# EAGLE board NeoKey 5x6 Ortho Snap-Apart (EAGLE 9.6.2), part 1 of 2
REV: B
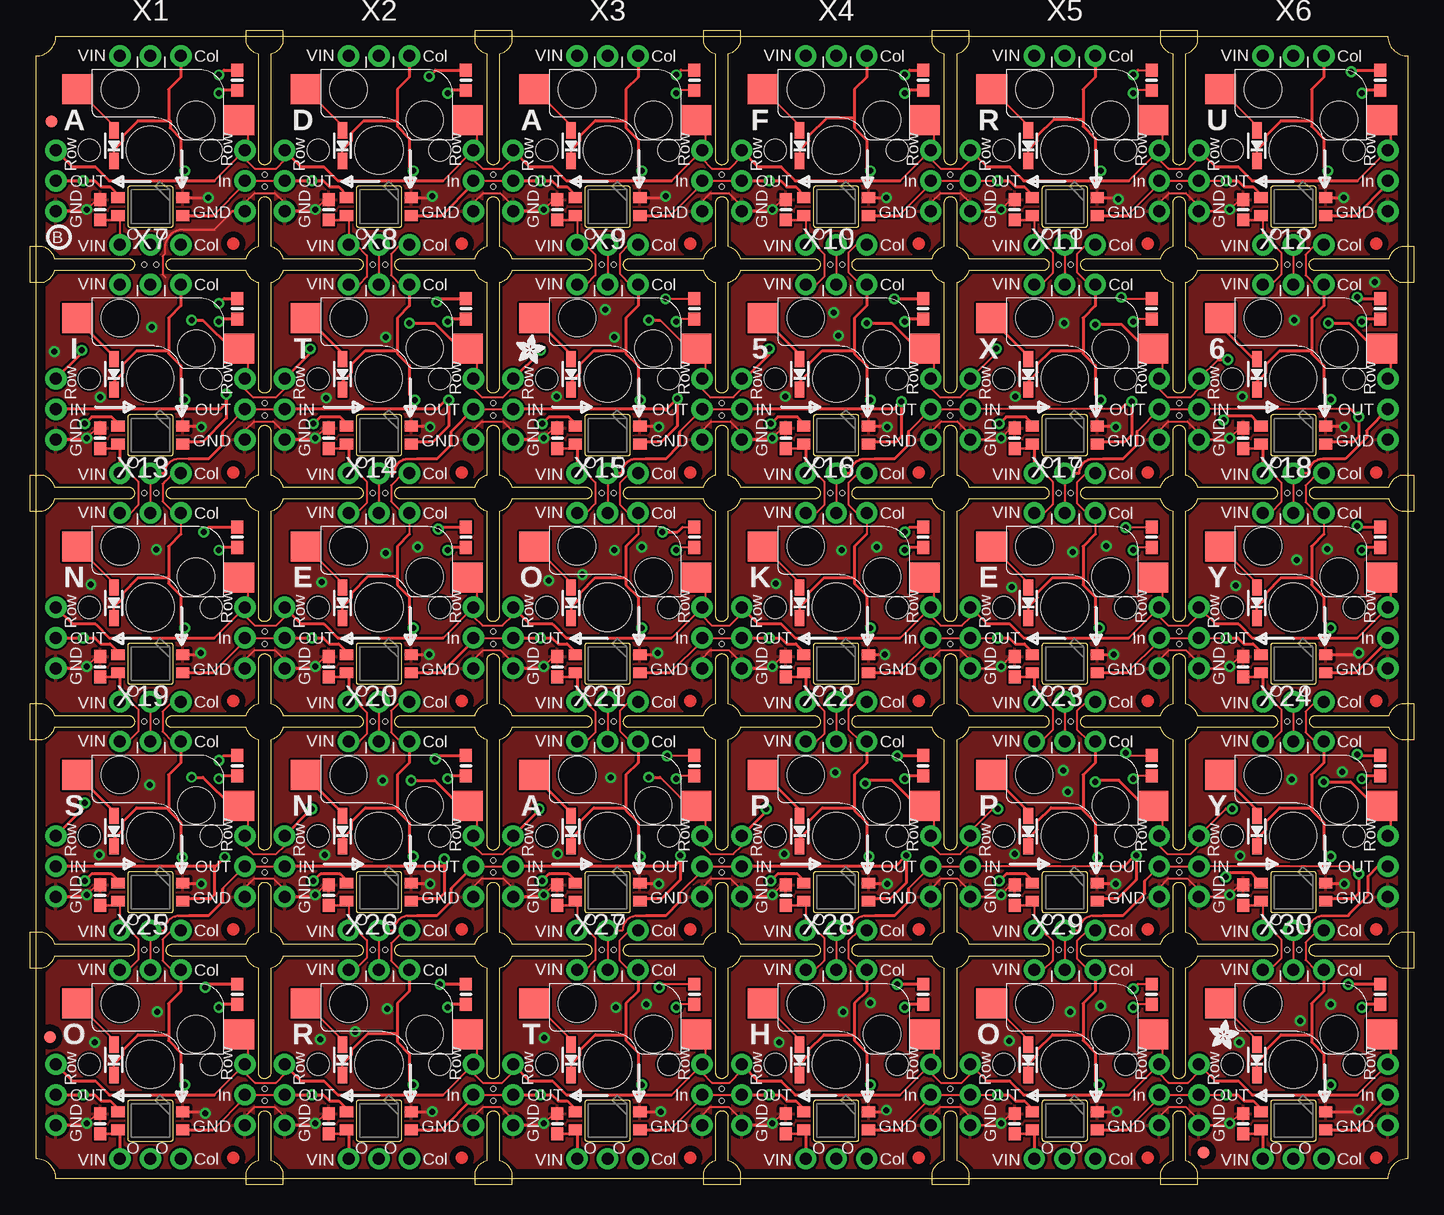
[diagram p1: board, top side]
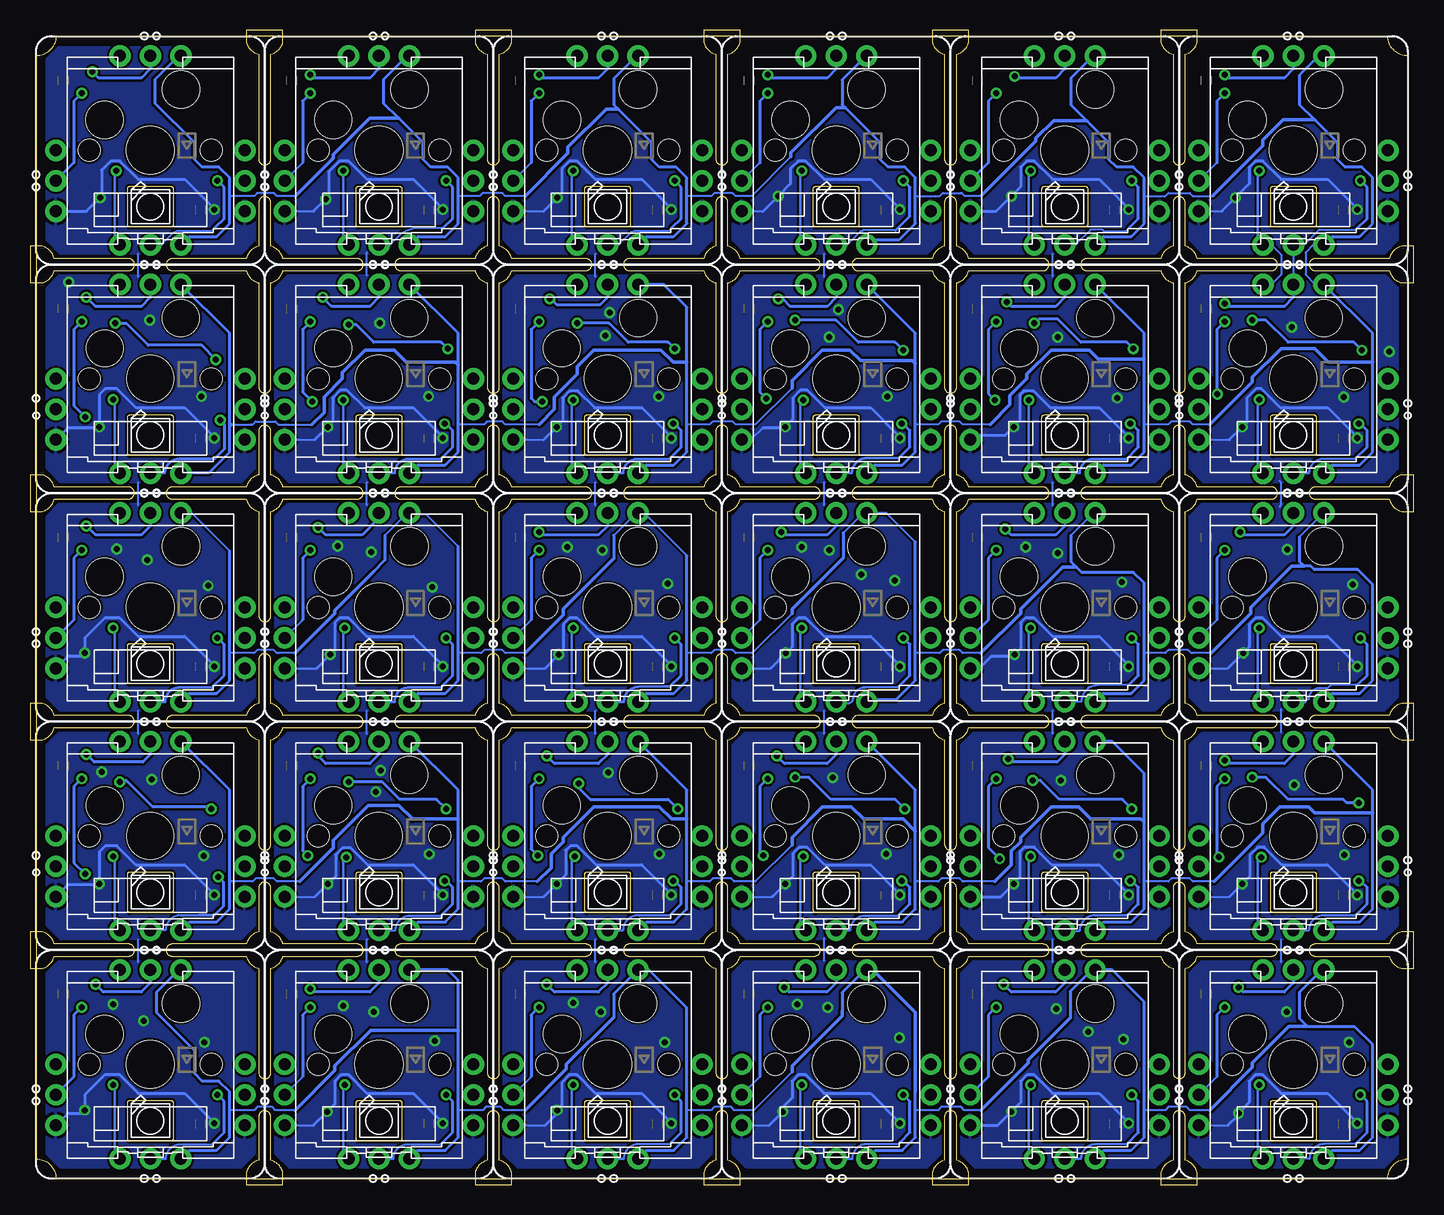
[diagram p2: board, bottom side, seen from below]

Size 115.32 x 96.27 mm. Coordinates in mm from the lower left corner, seen from the top.
Outline: 0.51,94.11 arc90 2.16,95.76 113.16,95.76 arc90 114.81,94.11 114.81,2.16 arc90 113.16,0.51 2.16,0.51 arc90 0.51,2.16 0.51,94.11
Copper layers (1*16): Top 0.035mm / dielectric 1.5mm / Bottom 0.035mm
Design rules "adafruit 7-7 *": minimum track width 7mil, minimum drill 15.5mil, track to track 7mil, track to pad 7mil, pad to pad 7mil, via to via 7mil, smd to smd 7mil, copper to edge 8mil, drill to drill 8mil, minimum pad ring 10mil, minimum via ring 8mil, stop-mask expansion 2mil, vias tented up to drill 20mil, thermal gap 10mil
Holes 0.4 mm at 19.56,83.19 38.61,83.19 57.66,83.19 76.71,83.19 95.76,83.19 9.52,76.71 10.54,76.71 28.58,76.71 29.59,76.71 47.62,76.71 48.64,76.71 66.67,76.71 67.69,76.71 85.72,76.71 86.74,76.71 104.78,76.71 105.79,76.71 19.56,65.15 19.56,64.14 38.61,65.15 38.61,64.14 57.66,65.15 57.66,64.14 76.71,65.15 76.71,64.14 95.76,65.15 95.76,64.14 9.52,57.66 10.54,57.66 28.58,57.66 29.59,57.66 47.62,57.66 48.64,57.66 66.67,57.66 67.69,57.66 85.72,57.66 86.74,57.66 104.78,57.66 105.79,57.66 19.56,46.1 19.56,45.09 38.61,46.1 38.61,45.09 57.66,46.1 57.66,45.09 76.71,46.1 76.71,45.09 95.76,46.1 95.76,45.09 9.52,38.61 10.54,38.61 28.58,38.61 29.59,38.61 47.62,38.61 48.64,38.61 66.67,38.61 67.69,38.61 85.72,38.61 86.74,38.61 104.78,38.61 105.79,38.61 19.56,27.05 19.56,26.04 38.61,27.05 38.61,26.04 57.66,27.05 57.66,26.04 76.71,27.05 76.71,26.04 95.76,27.05 95.76,26.04 9.52,19.56 10.54,19.56 28.58,19.56 29.59,19.56 47.62,19.56 48.64,19.56 66.67,19.56 67.69,19.56 85.72,19.56 86.74,19.56 104.78,19.56 105.79,19.56 19.56,8 19.56,6.98 38.61,8 38.61,6.98 57.66,8 57.66,6.98 76.71,8 76.71,6.98 95.76,8 95.76,6.98 95.76,84.2 76.71,84.2 57.66,84.2 38.61,84.2 19.56,84.2

## Footprints (pad centres in the part's own frame; a part is rotated, then mirrored left to right if it is on the bottom)
FIDUCIAL_1MM = smd 1 x 1: 1 0,0
KAILH_SOCKET_TILE = smd 1.1 x 0.9 bottom: 1-VDD 2.7,-5.449; 2-DOUT 2.7,-3.949; 3-GND -2.7,-3.949; 4-DIN -2.7,-5.449 | smd 2.55 x 2.5 bottom: A -7.36,2.5; DA 6.09,5.08 | drill 1 pad 1.778: A1 -7.874,0; A2 7.874,0; C1 -2.54,7.874; C2 -2.54,-7.874; DIN -7.874,-2.54; DIN_C 0,7.874; DOUT 7.874,-2.54; DOUT1 0,-7.874; GND1 -7.874,-5.08; GND2 7.874,-5.08; VDD1 2.54,7.874; VDD2 2.54,-7.874 | smd 0.8 x 1.35 bottom: C 3.048,-0.889; D+ 3.048,1.651 | smd 1 x 1.075 bottom: C+ 4.191,-5.803; C- 4.191,-4.103; DIN1 -7.239,4.992; DIN_C1 -7.239,6.692 | hole 4: 0,0 | hole 3.1: 2.54,5.08; -3.81,2.54 | hole 1.813: 5.08,0; -5.08,0
KAILH_SOCKET_TILE_REV = smd 1.1 x 0.9 bottom: 1-VDD 2.7,-5.449; 2-DOUT 2.7,-3.949; 3-GND -2.7,-3.949; 4-DIN -2.7,-5.449 | smd 2.55 x 2.5 bottom: A -7.36,2.5; DA 6.09,5.08 | drill 1 pad 1.778: A1 -7.874,0; A2 7.874,0; C1 -2.54,7.874; C2 -2.54,-7.874; DIN 7.874,-2.54; DIN_C 0,7.874; DOUT -7.874,-2.54; DOUT1 0,-7.874; GND1 -7.874,-5.08; GND2 7.874,-5.08; VDD1 2.54,7.874; VDD2 2.54,-7.874 | smd 0.8 x 1.35 bottom: C 3.048,-0.889; D+ 3.048,1.651 | smd 1 x 1.075 bottom: C+ 4.191,-5.803; C- 4.191,-4.103; DIN1 -7.239,4.992; DIN_C1 -7.239,6.692 | hole 3.9: 0,0 | hole 3.063: 2.54,5.08; -3.81,2.54 | hole 1.813: 5.08,0; -5.08,0

## Placement (x,y rotation side)
U$1  FIDUCIAL  [FIDUCIAL_1MM]  1.65,12.32 0 top
U$2  FIDUCIAL  [FIDUCIAL_1MM]  97.79,2.67 0 top
U$3  FIDUCIAL  [FIDUCIAL_1MM]  1.78,88.65 0 top
U$4  [ADAFRUIT_2.5MM]  40.51,68.45 0 top
U$5  [ADAFRUIT_2.5MM]  98.3,11.3 0 top
U$6  [PCBFEAT-REV-040]  2.41,78.99 180 top
X1  KAILH_SOCKET_TILE  [KAILH_SOCKET_TILE]  10.03,86.23 0 bottom
X2  KAILH_SOCKET_TILE  [KAILH_SOCKET_TILE]  29.08,86.23 0 bottom
X3  KAILH_SOCKET_TILE  [KAILH_SOCKET_TILE]  48.13,86.23 0 bottom
X4  KAILH_SOCKET_TILE  [KAILH_SOCKET_TILE]  67.18,86.23 0 bottom
X5  KAILH_SOCKET_TILE  [KAILH_SOCKET_TILE]  86.23,86.23 0 bottom
X6  KAILH_SOCKET_TILE  [KAILH_SOCKET_TILE]  105.28,86.23 0 bottom
X7  KAILH_SOCKET_TILE_REVERSE  [KAILH_SOCKET_TILE_REV]  10.03,67.18 0 bottom
X8  KAILH_SOCKET_TILE_REVERSE  [KAILH_SOCKET_TILE_REV]  29.08,67.18 0 bottom
X9  KAILH_SOCKET_TILE_REVERSE  [KAILH_SOCKET_TILE_REV]  48.13,67.18 0 bottom
X10  KAILH_SOCKET_TILE_REVERSE  [KAILH_SOCKET_TILE_REV]  67.18,67.18 0 bottom
X11  KAILH_SOCKET_TILE_REVERSE  [KAILH_SOCKET_TILE_REV]  86.23,67.18 0 bottom
X12  KAILH_SOCKET_TILE_REVERSE  [KAILH_SOCKET_TILE_REV]  105.28,67.18 0 bottom
X13  KAILH_SOCKET_TILE  [KAILH_SOCKET_TILE]  10.03,48.13 0 bottom
X14  KAILH_SOCKET_TILE  [KAILH_SOCKET_TILE]  29.08,48.13 0 bottom
X15  KAILH_SOCKET_TILE  [KAILH_SOCKET_TILE]  48.13,48.13 0 bottom
X16  KAILH_SOCKET_TILE  [KAILH_SOCKET_TILE]  67.18,48.13 0 bottom
X17  KAILH_SOCKET_TILE  [KAILH_SOCKET_TILE]  86.23,48.13 0 bottom
X18  KAILH_SOCKET_TILE  [KAILH_SOCKET_TILE]  105.28,48.13 0 bottom
X19  KAILH_SOCKET_TILE_REVERSE  [KAILH_SOCKET_TILE_REV]  10.03,29.08 0 bottom
X20  KAILH_SOCKET_TILE_REVERSE  [KAILH_SOCKET_TILE_REV]  29.08,29.08 0 bottom
X21  KAILH_SOCKET_TILE_REVERSE  [KAILH_SOCKET_TILE_REV]  48.13,29.08 0 bottom
X22  KAILH_SOCKET_TILE_REVERSE  [KAILH_SOCKET_TILE_REV]  67.18,29.08 0 bottom
X23  KAILH_SOCKET_TILE_REVERSE  [KAILH_SOCKET_TILE_REV]  86.23,29.08 0 bottom
X24  KAILH_SOCKET_TILE_REVERSE  [KAILH_SOCKET_TILE_REV]  105.28,29.08 0 bottom
X25  KAILH_SOCKET_TILE  [KAILH_SOCKET_TILE]  10.03,10.03 0 bottom
X26  KAILH_SOCKET_TILE  [KAILH_SOCKET_TILE]  29.08,10.03 0 bottom
X27  KAILH_SOCKET_TILE  [KAILH_SOCKET_TILE]  48.13,10.03 0 bottom
X28  KAILH_SOCKET_TILE  [KAILH_SOCKET_TILE]  67.18,10.03 0 bottom
X29  KAILH_SOCKET_TILE  [KAILH_SOCKET_TILE]  86.23,10.03 0 bottom
X30  KAILH_SOCKET_TILE  [KAILH_SOCKET_TILE]  105.28,10.03 0 bottom

## Tracks (layer width: path | path; a pad name or v marks a point on that pad's centre or on a via)
COL1  (via drill 0.5)
  Top 0.178: 12.57,54.23 X13.C1 12,56.01 11.05,56.96 11.05,58.42 11.24,58.61 11.3,58.67 11.94,59.31 X7.C2 | 11.87,40.26 11.05,39.43 11.05,37.78 11.87,36.96 | X19.C2 11.81,21.21 11.05,20.45 11.05,18.67 11.81,17.91
  Top 0.203: X1.C 6.98,86.25 | X7.C 6.98,66.95 | X13.C 6.98,48.15 | X19.C 6.98,28.85 | X13.C2 11.87,40.26 | 11.87,36.96 X19.C1 | X25.C 6.98,10.05 | 11.81,17.91 X25.C1
  Top 0.254: X1.C1 12.57,92.33 11.56,91.31 11.56,88.71 | v12.89,84.52 12.89,84.65 12.57,84.96 12.57,87.21 11.68,88.1 11.68,88.71 11.56,88.71 | 6.98,86.25 7.75,87.02 7.75,87.45 9.02,88.71 11.56,88.71 | X7.C1 12.57,73.28 11.56,72.26 11.56,69.53 | 11.56,69.53 11.56,69.3 12.57,68.29 12.57,65.79 v12.89,65.47 | 6.98,66.95 7.75,67.72 7.75,68.4 8.89,69.53 11.56,69.53 | 12.57,54.23 11.56,53.21 11.56,50.61 | 11.56,50.61 11.56,50.13 12.57,49.11 12.57,46.74 v12.89,46.42 | 6.98,48.15 7.75,48.92 7.75,49.35 9.02,50.61 11.56,50.61 | X19.C1 12.57,35.18 11.56,34.16 11.56,31.43 | 11.56,31.43 11.56,31.2 12.57,30.19 12.57,27.43 v12.7,27.31 | 6.98,28.85 7.75,29.62 7.75,30.3 8.89,31.43 11.56,31.43 | X25.C1 12.57,16.13 11.56,15.11 11.56,12.51 | 11.56,12.51 11.56,12.03 12.57,11.01 12.57,8.64 v12.89,8.32 | 6.98,10.05 7.75,10.82 7.75,11.25 9.02,12.51 11.56,12.51
  Bottom 0.178: 13.02,79.06 12.57,78.61 X1.C2 11.87,78.36 11.05,77.53 11.05,75.88 11.87,75.06 | 12.57,21.46 X19.C2
  Bottom 0.203: v12.89,84.52 13.02,84.39 13.02,79.06 | X7.C2 12.57,59.56 13.02,60.01 13.02,65.34 v12.89,65.47 | 11.87,75.06 X7.C1 | X13.C2 12.57,40.51 13.02,40.96 13.02,46.29 v12.89,46.42 | 12.57,21.46 13.02,21.91 13.02,26.99 v12.7,27.31 | X25.C2 12.57,2.41 13.02,2.86 13.02,8.19 v12.89,8.32
COL2  (via drill 0.5)
  Top 0.178: X2.C2 30.86,78.36 30.1,77.6 30.1,75.82 30.86,75.06 | 31.62,54.23 X14.C1 31.05,56.01 30.1,56.96 30.1,58.29 31.12,59.31 X8.C2 | 30.86,40.26 30.1,39.5 30.1,37.72 30.86,36.96 | X20.C2 31.18,21.21 30.1,20.13 30.1,18.67 30.86,17.91
  Top 0.203: X2.C 26.03,86.25 | X8.C 26.03,66.95 | 30.86,75.06 X8.C1 | X14.C 26.03,48.15 | X20.C 26.03,28.85 | X14.C2 30.86,40.26 | 30.86,36.96 X20.C1 | X26.C 26.03,10.05 | 30.86,17.91 X26.C1
  Top 0.254: X2.C1 31.62,92.33 30.61,91.31 30.61,88.71 | 30.61,88.71 30.61,88.23 31.62,87.21 31.62,84.84 v31.94,84.52 | 26.03,86.25 26.8,87.02 26.8,87.7 27.81,88.71 30.61,88.71 | X8.C1 31.62,73.28 30.61,72.26 30.61,69.53 | 30.61,69.53 30.61,69.3 31.62,68.29 31.62,65.85 v32.07,65.41 | 26.03,66.95 26.8,67.72 26.8,68.4 27.94,69.53 30.61,69.53 | 31.62,54.23 30.61,53.21 30.61,50.74 | 30.61,50.74 30.61,50 31.62,48.98 31.62,46.74 v31.94,46.42 | 26.03,48.15 26.8,48.92 26.8,49.35 28.19,50.74 30.61,50.74 | X20.C1 31.62,35.18 30.61,34.16 30.61,31.43 | 30.61,31.43 30.61,31.2 31.62,30.19 31.62,27.69 v31.94,27.37 | 26.03,28.85 26.8,29.62 26.8,30.3 27.94,31.43 30.61,31.43 | X26.C1 31.62,16.13 30.61,15.11 30.61,12.64 | 30.61,12.64 30.61,11.9 31.62,10.88 31.62,8.64 v31.94,8.32 | 26.03,10.05 26.8,10.82 26.8,11.25 28.19,12.64 30.61,12.64
  Bottom 0.178: 32.07,79.06 31.62,78.61 X2.C2 | 31.62,21.46 X20.C2
  Bottom 0.203: v31.94,84.52 32.07,84.39 32.07,79.06 | X8.C2 31.62,59.56 32.07,60.01 v32.07,65.41 | X14.C2 31.62,40.51 32.07,40.96 32.07,46.42 v31.94,46.42 | 31.62,21.46 32.07,21.91 32.07,27.24 v31.94,27.37 | X26.C2 31.62,2.41 32.07,2.86 32.07,8.19 v31.94,8.32
COL3  (via drill 0.5)
  Top 0.178: X3.C2 49.91,78.36 49.15,77.6 49.15,75.95 50.04,75.06 | 50.67,54.23 X15.C1 49.85,56.01 49.15,56.71 49.15,58.48 49.97,59.31 X9.C2 | 49.91,40.26 49.15,39.5 49.15,37.85 50.04,36.96 | X21.C2 49.97,21.21 49.15,20.38 49.15,18.67 49.91,17.91
  Top 0.203: X3.C 45.09,86.25 | X9.C 45.09,66.95 | 50.04,75.06 X9.C1 | X15.C 45.09,48.15 | X21.C 45.09,28.85 | X15.C2 49.91,40.26 | 50.04,36.96 X21.C1 | X27.C 45.09,10.05 | X27.C1 49.91,17.91
  Top 0.254: X3.C1 50.67,92.33 49.66,91.31 49.66,88.71 | 49.66,88.71 49.66,88.1 50.67,87.08 50.67,84.84 v50.99,84.52 | 45.09,86.25 45.85,87.02 45.85,87.45 47.12,88.71 49.66,88.71 | X9.C1 50.67,73.28 49.66,72.26 49.66,69.53 | 49.66,69.53 49.66,69.3 50.67,68.29 50.67,65.6 v50.86,65.41 | 45.09,66.95 45.85,67.72 45.85,68.4 46.99,69.53 49.66,69.53 | 50.67,54.23 49.66,53.21 49.66,50.61 | 49.66,50.61 49.66,50 50.67,48.98 50.67,46.74 v50.99,46.42 | 45.09,48.15 45.85,48.92 45.85,49.35 47.12,50.61 49.66,50.61 | X21.C1 50.67,35.18 49.66,34.16 49.66,31.43 | 49.66,31.43 49.66,31.2 50.67,30.19 50.67,27.56 v50.86,27.37 | 45.09,28.85 45.85,29.62 45.85,30.3 46.99,31.43 49.66,31.43 | X27.C1 50.67,16.13 49.66,15.11 49.66,12.51 | 49.66,12.51 49.66,12.03 50.67,11.01 50.67,8.64 v50.99,8.32 | 45.09,10.05 45.85,10.82 45.85,11.25 47.12,12.51 49.66,12.51
  Bottom 0.178: 51.12,79.06 50.67,78.61 X3.C2 | 50.67,21.46 X21.C2
  Bottom 0.203: v50.99,84.52 51.12,84.39 51.12,79.06 | X9.C2 50.67,59.56 51.12,60.01 51.12,65.41 v50.86,65.41 | X15.C2 50.67,40.51 51.12,40.96 51.12,46.29 v50.99,46.42 | 50.67,21.46 51.12,21.91 51.12,27.12 v50.86,27.37 | X27.C2 50.67,2.41 51.12,2.86 51.12,8.19 v50.99,8.32
COL4  (via drill 0.5)
  Top 0.178: X4.C2 68.83,78.36 68.2,77.72 68.2,76.07 69.22,75.06 | 69.72,54.23 X16.C1 68.9,56.01 68.2,56.71 68.2,58.48 69.02,59.31 X10.C2 | 69.22,36.96 68.2,37.97 68.2,39.62 68.83,40.26 | X22.C2 69.09,21.21 68.2,20.32 68.2,18.86 69.15,17.91
  Top 0.203: X4.C 64.13,86.25 | X10.C 64.13,66.95 | 69.22,75.06 X10.C1 | X16.C 64.13,48.15 | X22.C 64.13,28.85 | X16.C2 68.83,40.26 | 69.22,36.96 X22.C1 | X28.C 64.13,10.05 | 69.15,17.91 X28.C1
  Top 0.254: X4.C1 69.72,92.33 68.71,91.31 68.71,88.96 | 68.71,88.96 68.71,88.1 69.72,87.08 69.72,84.71 69.91,84.52 v70.04,84.52 | 64.13,86.25 64.9,87.02 64.9,87.45 66.42,88.96 68.71,88.96 | X10.C1 69.72,73.28 68.71,72.26 68.71,69.53 | 68.71,69.53 68.71,69.3 69.72,68.29 69.72,65.72 v70.04,65.41 | 64.13,66.95 64.9,67.72 64.9,68.4 66.04,69.53 68.71,69.53 | 69.72,54.23 68.71,53.21 68.71,50.61 | 68.71,50.61 68.71,50.13 69.72,49.11 69.72,46.61 69.91,46.42 v70.04,46.42 | 64.13,48.15 64.9,48.92 64.9,49.35 66.17,50.61 68.71,50.61 | X22.C1 69.72,35.18 68.71,34.16 68.71,31.43 | 68.71,31.43 68.71,31.2 69.72,30.19 69.72,27.56 v69.91,27.37 | 64.13,28.85 64.9,29.62 64.9,30.3 66.04,31.43 68.71,31.43 | X28.C1 69.72,16.13 68.71,15.11 68.71,12.51 | 68.71,12.51 68.71,12.03 69.72,11.01 69.72,8.64 v70.04,8.32 | 64.13,10.05 64.9,10.82 64.9,11.25 66.17,12.51 68.71,12.51
  Bottom 0.178: 70.17,79.06 69.72,78.61 X4.C2 | 69.72,21.46 X22.C2
  Bottom 0.203: v70.04,84.52 70.17,84.39 70.17,79.06 | X10.C2 69.72,59.56 70.17,60.01 70.17,65.41 v70.04,65.41 | X16.C2 69.72,40.51 70.17,40.96 70.17,46.29 v70.04,46.42 | 69.72,21.46 70.17,21.91 70.17,27.12 v69.91,27.37 | X28.C2 69.72,2.41 70.17,2.86 70.17,8.19 v70.04,8.32
COL5  (via drill 0.5)
  Top 0.178: X5.C2 88.01,78.36 87.25,77.6 87.25,76.07 88.27,75.06 | X17.C1 88.77,55.88 | 88.77,55.88 88.77,54.23 | 88.27,36.96 87.25,37.97 87.25,39.5 88.01,40.26 | X11.C2 88.01,59.31 87.25,58.55 87.25,56.83 88.2,55.88 88.77,55.88 | X23.C2 88.14,21.21 87.25,20.32 87.25,18.86 88.33,17.78
  Top 0.203: X5.C 83.19,86.25 | X11.C 83.19,66.95 | 88.27,75.06 X11.C1 | X17.C 83.19,48.15 | X23.C 83.19,28.85 | X17.C2 88.01,40.26 | 88.27,36.96 X23.C1 | X29.C 83.19,10.05 | 88.33,17.78 88.77,17.78
  Top 0.254: X5.C1 88.77,92.33 87.76,91.31 87.76,88.84 | 87.76,88.84 87.76,88.23 88.77,87.21 88.77,84.96 v89.22,84.52 | 83.19,86.25 83.95,87.02 83.95,87.45 85.34,88.84 87.76,88.84 | X11.C1 88.77,73.28 87.76,72.26 87.76,69.53 | 87.76,69.53 87.76,69.3 88.77,68.29 88.77,65.85 v89.22,65.41 | 83.19,66.95 83.95,67.72 83.95,68.4 85.09,69.53 87.76,69.53 | 88.77,54.23 87.76,53.21 87.76,50.61 | 87.76,50.61 87.76,50 88.77,48.98 88.77,46.74 v89.09,46.42 | 83.19,48.15 83.95,48.92 83.95,49.35 85.22,50.61 87.76,50.61 | X23.C1 88.77,35.18 87.76,34.16 87.76,31.43 | 87.76,31.43 87.76,31.2 88.77,30.19 88.77,27.56 88.96,27.37 v88.96,27.31 | 83.19,28.85 83.95,29.62 83.95,30.3 85.09,31.43 87.76,31.43 | X29.C1 88.77,17.78 88.77,16.13 87.76,15.11 87.76,12.51 | 87.76,12.51 87.76,12.03 88.77,11.01 88.77,8.64 v89.09,8.32 | 83.19,10.05 83.95,10.82 83.95,11.25 85.22,12.51 87.76,12.51
  Bottom 0.178: 89.22,79.06 88.77,78.61 X5.C2 | 88.77,21.46 X23.C2
  Bottom 0.203: v89.22,84.52 89.22,79.06 | X11.C2 88.77,59.56 89.22,60.01 v89.22,65.41 | X17.C2 88.77,40.51 89.22,40.96 89.22,46.29 v89.09,46.42 | 88.77,21.46 89.22,21.91 89.22,27.05 v88.96,27.31 | X29.C2 88.77,2.41 89.22,2.86 89.22,8.19 v89.09,8.32
COL6  (via drill 0.5)
  Top 0.178: X6.C2 107.12,78.36 106.3,77.53 106.3,75.82 107.06,75.06 | 107.82,54.23 X18.C1 107.19,56.01 106.3,56.9 106.3,58.29 107.31,59.31 X12.C2 | 107.12,40.26 106.3,39.43 106.3,37.72 107.06,36.96 | X24.C2 107.31,21.21 106.3,20.19 106.3,18.73 107.12,17.91
  Top 0.203: X6.C 102.23,86.25 | X12.C 102.23,66.95 | 107.06,75.06 X12.C1 | X18.C 102.23,48.15 | X24.C 102.23,28.85 | X18.C2 107.12,40.26 | 107.06,36.96 X24.C1 | X30.C 102.23,10.18 | 107.12,17.91 X30.C1
  Top 0.254: X6.C1 107.82,92.33 106.81,91.31 106.81,88.71 | 106.81,88.71 106.81,88.23 107.82,87.21 107.82,84.84 v108.14,84.52 | 102.23,86.25 103,87.02 103,87.45 104.27,88.71 106.81,88.71 | X12.C1 107.82,73.28 106.81,72.26 106.81,69.53 | 106.81,69.53 106.81,69.3 107.82,68.29 107.82,66.04 v108.39,65.47 | 102.23,66.95 103,67.72 103,68.4 104.14,69.53 106.81,69.53 | 107.82,54.23 106.81,53.21 106.81,50.61 | 106.81,50.61 106.81,50 107.82,48.98 107.82,46.99 v108.39,46.42 | 102.23,48.15 103,48.92 103,49.35 104.27,50.61 106.81,50.61 | X24.C1 107.82,35.18 106.81,34.16 106.81,31.43 | 106.81,31.43 106.81,31.2 107.82,30.19 107.82,27.94 v108.39,27.37 | 102.23,28.85 103,29.62 103,30.3 104.14,31.43 106.81,31.43 | X30.C1 107.82,16.13 106.81,15.11 106.81,12.51 | 106.81,12.51 106.81,11.9 107.82,10.88 107.82,8.89 v108.39,8.32 | 102.23,10.18 103,10.95 103,11.25 104.27,12.51 106.81,12.51
  Bottom 0.178: 108.27,79.06 107.82,78.61 X6.C2 | 107.82,21.46 X24.C2
  Bottom 0.203: v108.14,84.52 108.27,84.39 108.27,79.06 | X12.C2 107.82,59.56 108.27,60.01 108.27,65.34 v108.39,65.47 | X18.C2 107.82,40.51 108.27,40.96 108.27,46.29 v108.39,46.42 | 107.82,21.46 108.27,21.91 108.27,27.24 v108.39,27.37 | X30.C2 107.82,2.41 108.27,2.86 108.27,8.19 v108.39,8.32
GND  (via drill 0.5)
  Top 0.178: X2.GND2 21.21,81.85 20.38,82.68 18.73,82.68 17.91,81.85 X1.GND1 16.89,81.15 | X2.GND1 36.96,81.85 37.78,82.68 39.18,82.68 40.26,81.6 X3.GND2 | 80.77,81.15 X5.GND2 78.36,81.85 77.53,82.68 75.88,82.68 75.06,81.85 X4.GND1 | 99.82,81.15 X6.GND2 97.41,81.6 96.33,82.68 94.93,82.68 94.11,81.85 X5.GND1 | X3.GND1 56.01,81.98 56.7,82.68 58.23,82.68 59.31,81.6 X4.GND2 | X7.GND1 17.91,62.87 18.67,63.63 20.26,63.63 21.21,62.68 | X9.GND1 56.01,62.87 56.77,63.63 58.36,63.63 59.31,62.68 | 80.77,62.1 X11.GND2 78.36,62.55 77.28,63.63 75.95,63.63 75.06,62.74 X10.GND1 | 99.82,62.1 X12.GND2 97.41,62.68 96.46,63.63 94.87,63.63 94.11,62.87 X11.GND1 | X8.GND1 36.96,62.93 37.66,63.63 39.43,63.63 40.26,62.8 X9.GND2 | X13.GND1 17.91,43.75 18.73,44.58 20.38,44.58 21.21,43.75 X14.GND2 | X14.GND1 36.96,43.75 37.78,44.58 39.18,44.58 40.26,43.5 X15.GND2 | 80.77,43.05 X17.GND2 78.36,43.75 77.53,44.58 75.88,44.58 75.06,43.75 X16.GND1 | 99.82,43.05 X18.GND2 97.41,43.5 96.33,44.58 94.93,44.58 94.11,43.75 X17.GND1 | X15.GND1 56.01,43.88 56.7,44.58 58.23,44.58 59.31,43.5 X16.GND2 | X19.GND1 17.91,24.77 18.67,25.53 20.26,25.53 21.21,24.58 | X21.GND1 56.01,24.77 56.77,25.53 58.36,25.53 59.31,24.58 | 80.77,24 X23.GND2 78.36,24.45 77.28,25.53 75.95,25.53 75.06,24.64 X22.GND1 | 99.82,24 X24.GND2 97.41,24.58 96.46,25.53 94.87,25.53 94.11,24.77 X23.GND1 | X20.GND1 36.96,24.83 37.66,25.53 39.43,25.53 40.26,24.7 X21.GND2 | X25.GND1 17.91,5.65 18.73,6.48 20.38,6.48 21.21,5.65 X26.GND2 | X26.GND1 36.96,5.65 37.78,6.48 39.18,6.48 40.26,5.4 X27.GND2 | 80.77,4.95 X29.GND2 78.36,5.65 77.53,6.48 75.88,6.48 75.06,5.65 X28.GND1
  Top 0.178: 99.82,4.95 X30.GND2 97.41,5.4 96.33,6.48 94.93,6.48 94.11,5.65 X29.GND1 | X27.GND1 56.01,5.78 56.7,6.48 58.23,6.48 59.31,5.4 X28.GND2 | 12.76,79.63 arc90 11.24,78.11 11.24,77.6 11.05,77.41 11.05,75.88 11.3,75.63
  Top 0.203: X1.C- 5.55,82.13 v4.72,81.31 | X2.C- 24.6,82.13 v23.77,81.31 | X3.C- 43.65,82.13 v42.82,81.31 | X4.C- 62.7,82.13 v61.87,81.31 | X5.C- 81.75,82.13 v80.92,81.31 | X6.C- 100.8,82.13 v99.97,81.31 | X7.C- 5.55,63.08 v4.72,62.25 | X8.C- 24.6,63.08 v23.77,62.25 | 21.21,62.68 X8.GND2 | X9.C- 43.65,63.08 v42.82,62.25 | X10.C- 62.7,63.08 v61.87,62.25 | 59.31,62.68 X10.GND2 | X11.C- 81.75,63.08 v80.92,62.25 | X12.C- 100.8,63.08 v99.97,62.25 | X13.C- 5.55,44.03 v4.72,43.2 | X14.C- 24.6,44.03 v23.77,43.2 | X15.C- 43.65,44.03 v42.82,43.2 | X16.C- 62.7,44.03 v61.87,43.2 | X17.C- 81.75,44.03 v80.92,43.2 | X18.C- 100.8,44.03 v99.97,43.2 | X19.C- 5.55,24.98 v4.72,24.16 | X20.C- 24.6,24.98 v23.77,24.16 | 21.21,24.58 X20.GND2 | X21.C- 43.65,24.98 v42.82,24.16 | X22.C- 62.7,24.98 v61.87,24.16 | 59.31,24.58 X22.GND2 | X23.C- 81.75,24.98 v80.92,24.16 | X24.C- 100.8,24.98 v99.97,24.16 | X25.C- 5.55,5.93 v4.72,5.1 | X26.C- 24.6,5.93 v23.77,5.1 | X27.C- 43.65,5.93 v42.82,5.1 | X28.C- 62.7,5.93 v61.87,5.1 | X29.C- 81.75,5.93 v80.92,5.1 | X30.C- 100.8,5.93 v99.97,5.1 | 16.89,81.15 15.37,79.63 12.76,79.63
  Top 0.254: v4.72,81.31 4.57,81.15 X1.GND2 | v14.86,82.3 14.85,82.28 X1.3-GND | v23.77,81.31 23.62,81.15 X2.GND2 | v33.53,82.42 33.39,82.28 X2.3-GND | v42.82,81.31 42.67,81.15 X3.GND2 | v52.96,82.42 52.82,82.28 X3.3-GND | v61.87,81.31 61.72,81.15 X4.GND2 | v71.37,82.3 v71.36,82.28 X4.3-GND | v80.92,81.31 80.77,81.15 | v90.68,82.17 90.56,82.28 X5.3-GND | v99.97,81.31 99.82,81.15 | v109.47,82.3 v109.46,82.28 X6.3-GND | v4.72,62.25 4.57,62.1 X7.GND2 | v14.29,63.18 14.24,63.23 X7.3-GND | v23.77,62.25 23.62,62.1 X8.GND2 | v33.34,63.18 33.29,63.23 X8.3-GND | v42.82,62.25 42.67,62.1 X9.GND2 | v52.39,63.18 52.34,63.23 X9.3-GND | v61.87,62.25 61.72,62.1 X10.GND2 | v71.44,63.18 71.39,63.23 X10.3-GND | v80.92,62.25 80.77,62.1 | v90.49,63.18 90.44,63.23 X11.3-GND | v99.97,62.25 99.82,62.1 | v109.54,63.18 109.49,63.23 X12.3-GND | v4.72,43.2 4.57,43.05 X13.GND2 | v14.22,44.32 14.08,44.18 X13.3-GND | v23.77,43.2 23.62,43.05 X14.GND2 | v33.27,44.2 33.26,44.18 X14.3-GND | v42.82,43.2 42.67,43.05 X15.GND2 | v52.32,44.32 52.19,44.18 X15.3-GND | v61.87,43.2 61.72,43.05 X16.GND2 | v71.25,44.2 v71.23,44.18 X16.3-GND | v80.92,43.2 80.77,43.05 | v90.3,44.2 v90.28,44.18 X17.3-GND | v99.97,43.2 99.82,43.05 | v110.74,44.32 110.61,44.18 X18.3-GND | v4.72,24.16 4.57,24 X19.GND2 | v14.29,25.08 14.24,25.13 X19.3-GND | v23.77,24.16 23.62,24 X20.GND2 | v33.34,25.08 33.29,25.13 X20.3-GND | v42.82,24.16 42.67,24 X21.GND2 | v52.39,25.08 52.34,25.13 X21.3-GND | v61.87,24.16 61.72,24 X22.GND2 | v71.44,25.08 71.39,25.13 X22.3-GND | v80.92,24.16 80.77,24 | v90.49,25.08 90.44,25.13 X23.3-GND | v99.97,24.16 99.82,24 | v109.54,25.08 109.49,25.13 X24.3-GND | v4.72,5.1 4.57,4.95 X25.GND2
  Top 0.254: v14.61,5.97 14.49,6.08 X25.3-GND | v23.77,5.1 23.62,4.95 X26.GND2 | v33.53,6.1 33.52,6.08 X26.3-GND | v42.82,5.1 42.67,4.95 X27.GND2 | v52.58,6.1 52.57,6.08 X27.3-GND | v61.87,5.1 61.72,4.95 X28.GND2 | v71.37,6.22 71.23,6.08 X28.3-GND | v80.92,5.1 80.77,4.95 | v90.55,6.1 90.54,6.08 X29.3-GND | v99.97,5.1 99.82,4.95 | v110.74,6.22 110.61,6.08 X30.3-GND
  Bottom 0.178: X1.GND1 16,81.15 | X3.GND1 54.23,81.15 | X4.GND1 72.52,81.15 | X5.GND1 91.69,81.15 | X7.GND1 15.37,62.1 | X9.GND1 55.25,62.1 54.23,63.12 | X10.GND1 72.52,62.1 | X11.GND1 91.57,62.1 | X13.GND1 15.49,43.05 | X15.GND1 53.59,43.05 | X16.GND1 72.39,43.05 | X17.GND1 91.44,43.05 | X19.GND1 15.37,24 | X21.GND1 53.47,24 | X22.GND1 72.52,24 | X23.GND1 91.57,24 | X25.GND1 15.49,4.95 | X27.GND1 53.72,4.95 | X28.GND1 72.39,4.95 | X29.GND1 91.69,4.95 | 11.18,56.52 11.05,56.64 11.05,58.55 11.18,58.67 | 11.05,37.72 11.05,39.62 | 11.05,18.54 11.05,20.45 | 30.1,75.69 30.1,77.6 | 30.1,56.64 30.1,58.55 | 30.1,37.59 30.1,39.5 | 30.1,18.54 30.1,20.45 | 49.15,75.69 49.15,77.6 | 49.15,56.64 49.15,58.55 | 49.15,37.59 49.15,39.5 | 49.15,18.67 49.15,20.57 | 68.2,75.69 68.2,77.6 | 87.25,75.82 87.25,77.72 | 106.3,75.69 106.3,77.6 | 68.2,37.59 68.2,39.5 | 68.2,56.64 68.2,58.55 | 87.25,56.64 87.25,58.55 | 106.3,56.64 106.3,58.55 | 106.3,37.59 106.3,39.5 | 87.25,37.59 87.25,39.5 | 87.25,18.54 87.25,20.45 | 106.3,18.54 106.3,20.45 | 68.2,18.54 68.2,20.45
  Bottom 0.254: 16,81.15 v14.86,82.3 13.72,83.44 13.72,84.84 13.21,85.34 12.57,85.34 11.05,83.82 7.17,83.82 4.72,81.37 v4.72,81.31 | X2.GND1 34.8,81.15 v33.53,82.42 32.77,83.19 32.77,84.84 32.26,85.34 31.62,85.34 30.1,83.82 26.22,83.82 23.77,81.37 v23.77,81.31 | 54.23,81.15 v52.96,82.42 51.94,83.44 51.94,84.71 51.31,85.34 50.67,85.34 49.15,83.82 45.27,83.82 42.82,81.37 v42.82,81.31 | 72.52,81.15 v71.37,82.3 70.99,82.68 70.99,84.71 70.36,85.34 69.72,85.34 68.2,83.82 64.32,83.82 61.87,81.37 v61.87,81.31 | 91.69,81.15 v90.68,82.17 90.42,82.42 90.42,84.45 89.53,85.34 88.77,85.34 87.25,83.82 83.37,83.82 80.92,81.37 v80.92,81.31 | X6.GND1 110.62,81.15 v109.47,82.3 109.35,82.42 109.35,84.58 108.59,85.34 107.82,85.34 106.3,83.82 102.42,83.82 99.97,81.37 v99.97,81.31 | 15.37,62.1 v14.29,63.18 13.91,63.56 13.91,65.6 13.14,66.36 12.7,66.36 11.11,64.77 7.17,64.77 4.72,62.32 v4.72,62.25 | X8.GND1 36.58,62.48 34.04,62.48 v33.34,63.18 32.83,63.69 32.83,65.85 32.51,66.17 31.69,66.17 30.29,64.77 26.22,64.77 23.77,62.32 v23.77,62.25 | 54.23,63.12 52.45,63.12 v52.39,63.18 51.75,63.82 51.75,65.6 51.12,66.23 50.55,66.23 49.09,64.77 45.27,64.77 42.82,62.32 v42.82,62.25 | 72.52,62.1 v71.44,63.18 70.93,63.69 70.93,65.6 70.36,66.17 69.66,66.17 68.26,64.77 64.32,64.77 61.87,62.32 v61.87,62.25 | 91.57,62.1 v90.49,63.18 90.11,63.56 90.11,65.6 89.47,66.23 88.9,66.23 87.44,64.77 83.37,64.77 80.92,62.32 v80.92,62.25 | X12.GND1 112.14,63.12 109.6,63.12 v109.54,63.18 109.54,65.85 109.03,66.36 108.08,66.36 106.49,64.77 102.42,64.77 99.97,62.32 v99.97,62.25 | 15.49,43.05 v14.22,44.32 13.72,44.83 13.72,46.74 13.21,47.24 12.57,47.24 11.05,45.72 7.17,45.72 4.72,43.27 v4.72,43.2
  Bottom 0.254: X14.GND1 36.2,43.05 35.18,44.07 33.4,44.07 v33.27,44.2 32.77,44.7 32.77,46.86 32.38,47.24 31.62,47.24 30.1,45.72 26.22,45.72 23.77,43.27 v23.77,43.2 | 53.59,43.05 v52.32,44.32 51.82,44.83 51.82,46.74 51.31,47.24 50.67,47.24 49.15,45.72 45.27,45.72 42.82,43.27 v42.82,43.2 | 72.39,43.05 v71.25,44.2 70.87,44.58 70.87,46.74 70.36,47.24 69.72,47.24 68.2,45.72 64.32,45.72 61.87,43.27 v61.87,43.2 | 91.44,43.05 v90.3,44.2 89.92,44.58 89.92,46.86 89.53,47.24 88.77,47.24 87.25,45.72 83.37,45.72 80.92,43.27 v80.92,43.2 | X18.GND1 112.14,44.07 111,44.07 v110.74,44.32 110.74,45.59 109.09,47.24 107.82,47.24 106.3,45.72 102.42,45.72 99.97,43.27 v99.97,43.2 | 15.37,24 v14.29,25.08 13.65,25.72 13.65,27.5 13.02,28.13 12.45,28.13 10.99,26.67 7.17,26.67 4.72,24.22 v4.72,24.16 | X20.GND1 34.42,24 v33.34,25.08 32.83,25.59 32.83,27.75 32.45,28.13 31.62,28.13 30.16,26.67 26.22,26.67 23.77,24.22 v23.77,24.16 | 53.47,24 v52.39,25.08 51.75,25.72 51.75,27.62 51.25,28.13 50.55,28.13 49.09,26.67 45.27,26.67 42.82,24.22 v42.82,24.16 | 72.52,24 v71.44,25.08 70.67,25.84 70.67,27.88 70.29,28.26 69.72,28.26 68.13,26.67 64.32,26.67 61.87,24.22 v61.87,24.16 | 91.57,24 v90.49,25.08 89.85,25.72 89.85,27.5 89.28,28.07 88.58,28.07 87.19,26.67 83.37,26.67 80.92,24.22 v80.92,24.16 | X24.GND1 112.14,25.02 109.6,25.02 v109.54,25.08 109.54,27.75 109.03,28.26 108.08,28.26 106.49,26.67 102.42,26.67 99.97,24.22 v99.97,24.16 | 15.49,4.95 14.61,5.84 v14.61,5.97 13.72,6.86 13.72,8.64 13.21,9.14 12.57,9.14 11.05,7.62 7.17,7.62 4.72,5.17 v4.72,5.1 | X26.GND1 34.67,4.95 v33.53,6.1 32.77,6.86 32.77,8.64 32.26,9.14 31.62,9.14 30.1,7.62 26.22,7.62 23.77,5.17 v23.77,5.1
  Bottom 0.254: 53.72,4.95 v52.58,6.1 52.77,6.29 51.82,7.24 51.82,8.64 51.31,9.14 50.67,9.14 49.15,7.62 45.27,7.62 42.82,5.17 v42.82,5.1 | 72.39,4.95 71.37,5.97 v71.37,6.22 70.99,6.6 70.99,8.51 70.36,9.14 69.72,9.14 68.2,7.62 64.32,7.62 61.87,5.17 v61.87,5.1 | 91.69,4.95 v90.55,6.1 89.92,6.73 89.92,8.64 89.41,9.14 88.77,9.14 87.25,7.62 83.37,7.62 80.92,5.17 v80.92,5.1 | X30.GND1 112.14,5.97 111,5.97 v110.74,6.22 110.74,7.49 109.09,9.14 107.82,9.14 106.3,7.62 102.42,7.62 99.97,5.17 v99.97,5.1
  other vias: 10.16,71.5 2.03,69.47 5.84,65.66 10.54,52.96 5.08,50.04 5.78,27.5 9.97,33.34 10.6,14.41 5.4,11.87 29.65,70.68 24.7,65.6 29.65,52.64 32.32,53.15 24.32,50.23 29.4,33.72 24.57,27.5 29.78,14.67 27.11,12.76 24.19,12.13 48.7,70.68 47.94,72.96 43.88,65.72 50.99,53.15 48.7,52.9 43.24,50.36 46.04,50.86 48.41,33.93 43.96,27.58 48.83,14.8 51.37,15.05 42.86,12.26 66.99,72.71 67.37,70.8 62.93,65.72 70.55,53.15 67.63,52.9 62.17,50.1 67.12,34.35 70.04,15.18 62.42,11.87 67.75,14.41 86.17,71.82 82.11,65.72 89.68,53.24 86.89,52.73 81.81,49.81 86.11,34.54 86.49,32.77 82.04,27.56 62.87,27.56 89.22,14.92 86.68,14.41 81.6,12 105.35,72.07 112.08,75.25 101.03,65.72 108.1,52.98 105.56,52.09 100.48,49.94 109.35,34.42 105.16,33.78 100.84,27.43 108.39,15.05 105.85,13.65 100.77,11.87
  pour Bottom: 2.35,75.82 1.33,74.8 1.33,59.69 2.48,58.55 17.53,58.55 18.67,59.69 18.67,74.8 17.65,75.82
  pour Top: 2.35,75.82 1.33,74.8 1.33,59.69 2.48,58.55 17.53,58.55 18.67,59.69 18.67,74.8 17.65,75.82
  pour Bottom: 2.35,94.87 1.33,93.85 1.33,78.74 2.48,77.6 17.53,77.6 18.67,78.74 18.67,93.85 17.65,94.87
  pour Top: 2.35,94.87 1.33,93.85 1.33,78.74 2.48,77.6 17.53,77.6 18.67,78.74 18.67,93.85 17.65,94.87
  pour Bottom: 2.35,56.77 1.33,55.75 1.33,40.64 2.48,39.5 17.53,39.5 18.67,40.64 18.67,55.75 17.65,56.77
  pour Top: 2.35,56.77 1.33,55.75 1.33,40.64 2.48,39.5 17.53,39.5 18.67,40.64 18.67,55.75 17.65,56.77
  pour Bottom: 2.35,37.72 1.33,36.7 1.33,21.59 2.48,20.45 17.53,20.45 18.67,21.59 18.67,36.7 17.65,37.72
  pour Top: 2.35,37.72 1.33,36.7 1.33,21.59 2.48,20.45 17.53,20.45 18.67,21.59 18.67,36.7 17.65,37.72
  pour Bottom: 2.35,18.67 1.33,17.65 1.33,2.54 2.48,1.4 17.53,1.4 18.67,2.54 18.67,17.65 17.65,18.67
  pour Top: 2.35,18.67 1.33,17.65 1.33,2.54 2.48,1.4 17.53,1.4 18.67,2.54 18.67,17.65 17.65,18.67
  pour Bottom: 21.4,94.87 20.38,93.85 20.38,78.74 21.53,77.6 36.58,77.6 37.72,78.74 37.72,93.85 36.7,94.87
  pour Top: 21.4,94.87 20.38,93.85 20.38,78.74 21.53,77.6 36.58,77.6 37.72,78.74 37.72,93.85 36.7,94.87
  pour Bottom: 21.4,75.82 20.38,74.8 20.38,59.69 21.53,58.55 36.58,58.55 37.72,59.69 37.72,74.8 36.7,75.82
  pour Top: 21.4,75.82 20.38,74.8 20.38,59.69 21.53,58.55 36.58,58.55 37.72,59.69 37.72,74.8 36.7,75.82
  pour Bottom: 21.4,56.77 20.38,55.75 20.38,40.64 21.53,39.5 36.58,39.5 37.72,40.64 37.72,55.75 36.7,56.77
  pour Top: 21.4,56.77 20.38,55.75 20.38,40.64 21.53,39.5 36.58,39.5 37.72,40.64 37.72,55.75 36.7,56.77
  pour Bottom: 21.4,37.72 20.38,36.7 20.38,21.59 21.53,20.45 36.58,20.45 37.72,21.59 37.72,36.7 36.7,37.72
  pour Top: 21.4,37.72 20.38,36.7 20.38,21.59 21.53,20.45 36.58,20.45 37.72,21.59 37.72,36.7 36.7,37.72
  pour Bottom: 21.4,18.67 20.38,17.65 20.38,2.54 21.53,1.4 36.58,1.4 37.72,2.54 37.72,17.65 36.7,18.67
  pour Top: 21.4,18.67 20.38,17.65 20.38,2.54 21.53,1.4 36.58,1.4 37.72,2.54 37.72,17.65 36.7,18.67
  pour Bottom: 40.45,94.87 39.43,93.85 39.43,78.74 40.58,77.6 55.63,77.6 56.77,78.74 56.77,93.85 55.75,94.87
  pour Top: 40.45,94.87 39.43,93.85 39.43,78.74 40.58,77.6 55.63,77.6 56.77,78.74 56.77,93.85 55.75,94.87
  pour Bottom: 40.45,75.82 39.43,74.8 39.43,59.69 40.58,58.55 55.63,58.55 56.77,59.69 56.77,74.8 55.75,75.82
  pour Top: 40.45,75.82 39.43,74.8 39.43,59.69 40.58,58.55 55.63,58.55 56.77,59.69 56.77,74.8 55.75,75.82
  pour Bottom: 40.45,56.77 39.43,55.75 39.43,40.64 40.58,39.5 55.63,39.5 56.77,40.64 56.77,55.75 55.75,56.77
  pour Top: 40.45,56.77 39.43,55.75 39.43,40.64 40.58,39.5 55.63,39.5 56.77,40.64 56.77,55.75 55.75,56.77
  pour Bottom: 40.45,37.72 39.43,36.7 39.43,21.59 40.58,20.45 55.63,20.45 56.77,21.59 56.77,36.7 55.75,37.72
  pour Top: 40.45,37.72 39.43,36.7 39.43,21.59 40.58,20.45 55.63,20.45 56.77,21.59 56.77,36.7 55.75,37.72
  pour Bottom: 40.45,18.67 39.43,17.65 39.43,2.54 40.58,1.4 55.63,1.4 56.77,2.54 56.77,17.65 55.75,18.67
  pour Top: 40.45,18.67 39.43,17.65 39.43,2.54 40.58,1.4 55.63,1.4 56.77,2.54 56.77,17.65 55.75,18.67
  pour Bottom: 59.5,94.87 58.48,93.85 58.48,78.74 59.63,77.6 74.68,77.6 75.82,78.74 75.82,93.85 74.8,94.87
  pour Top: 59.5,94.87 58.48,93.85 58.48,78.74 59.63,77.6 74.68,77.6 75.82,78.74 75.82,93.85 74.8,94.87
  pour Bottom: 78.55,94.87 77.53,93.85 77.53,78.74 78.68,77.6 93.73,77.6 94.87,78.74 94.87,93.85 93.85,94.87
  pour Top: 78.55,94.87 77.53,93.85 77.53,78.74 78.68,77.6 93.73,77.6 94.87,78.74 94.87,93.85 93.85,94.87
  pour Bottom: 97.6,94.87 96.58,93.85 96.58,78.74 97.73,77.6 112.78,77.6 113.92,78.74 113.92,93.85 112.9,94.87
  pour Top: 97.6,94.87 96.58,93.85 96.58,78.74 97.73,77.6 112.78,77.6 113.92,78.74 113.92,93.85 112.9,94.87
  pour Bottom: 59.5,75.82 58.48,74.8 58.48,59.69 59.63,58.55 74.68,58.55 75.82,59.69 75.82,74.8 74.8,75.82
  pour Top: 59.5,75.82 58.48,74.8 58.48,59.69 59.63,58.55 74.68,58.55 75.82,59.69 75.82,74.8 74.8,75.82
  pour Bottom: 59.5,56.77 58.48,55.75 58.48,40.64 59.63,39.5 74.68,39.5 75.82,40.64 75.82,55.75 74.8,56.77
  pour Top: 59.5,56.77 58.48,55.75 58.48,40.64 59.63,39.5 74.68,39.5 75.82,40.64 75.82,55.75 74.8,56.77
  pour Bottom: 59.5,37.72 58.48,36.7 58.48,21.59 59.63,20.45 74.68,20.45 75.82,21.59 75.82,36.7 74.8,37.72
  pour Top: 59.5,37.72 58.48,36.7 58.48,21.59 59.63,20.45 74.68,20.45 75.82,21.59 75.82,36.7 74.8,37.72
  pour Bottom: 59.5,18.67 58.48,17.65 58.48,2.54 59.63,1.4 74.68,1.4 75.82,2.54 75.82,17.65 74.8,18.67
  pour Top: 59.5,18.67 58.48,17.65 58.48,2.54 59.63,1.4 74.68,1.4 75.82,2.54 75.82,17.65 74.8,18.67
  pour Bottom: 78.55,75.82 77.53,74.8 77.53,59.69 78.68,58.55 93.73,58.55 94.87,59.69 94.87,74.8 93.85,75.82
  pour Top: 78.55,75.82 77.53,74.8 77.53,59.69 78.68,58.55 93.73,58.55 94.87,59.69 94.87,74.8 93.85,75.82
  pour Bottom: 78.55,56.77 77.53,55.75 77.53,40.64 78.68,39.5 93.73,39.5 94.87,40.64 94.87,55.75 93.85,56.77
  pour Top: 78.55,56.77 77.53,55.75 77.53,40.64 78.68,39.5 93.73,39.5 94.87,40.64 94.87,55.75 93.85,56.77
  pour Bottom: 78.55,37.72 77.53,36.7 77.53,21.59 78.68,20.45 93.73,20.45 94.87,21.59 94.87,36.7 93.85,37.72
  pour Top: 78.55,37.72 77.53,36.7 77.53,21.59 78.68,20.45 93.73,20.45 94.87,21.59 94.87,36.7 93.85,37.72
  pour Bottom: 78.55,18.67 77.53,17.65 77.53,2.54 78.68,1.4 93.73,1.4 94.87,2.54 94.87,17.65 93.85,18.67
  pour Top: 78.55,18.67 77.53,17.65 77.53,2.54 78.68,1.4 93.73,1.4 94.87,2.54 94.87,17.65 93.85,18.67
  pour Bottom: 97.6,75.82 96.58,74.8 96.58,59.69 97.73,58.55 112.78,58.55 113.92,59.69 113.92,74.8 112.9,75.82
  pour Top: 97.6,75.82 96.58,74.8 96.58,59.69 97.73,58.55 112.78,58.55 113.92,59.69 113.92,74.8 112.9,75.82
  pour Bottom: 97.6,56.77 96.58,55.75 96.58,40.64 97.73,39.5 112.78,39.5 113.92,40.64 113.92,55.75 112.9,56.77
  pour Top: 97.6,56.77 96.58,55.75 96.58,40.64 97.73,39.5 112.78,39.5 113.92,40.64 113.92,55.75 112.9,56.77
  pour Bottom: 97.6,37.72 96.58,36.7 96.58,21.59 97.73,20.45 112.78,20.45 113.92,21.59 113.92,36.7 112.9,37.72
  pour Top: 97.6,37.72 96.58,36.7 96.58,21.59 97.73,20.45 112.78,20.45 113.92,21.59 113.92,36.7 112.9,37.72
  pour Bottom: 97.6,18.67 96.58,17.65 96.58,2.54 97.73,1.4 112.78,1.4 113.92,2.54 113.92,17.65 112.9,18.67
  pour Top: 97.6,18.67 96.58,17.65 96.58,2.54 97.73,1.4 112.78,1.4 113.92,2.54 113.92,17.65 112.9,18.67
N$1  (via drill 0.5)
  Top 0.178: 15.25,80.78 17.91,83.44 X1.DIN X2.DOUT | X2.DOUT1 X8.DIN_C
  Top 0.203: 26.43,82.47 X2.2-DOUT
  Top 0.254: X1.4-DIN 15.25,80.78 | X1.DIN1 15.98,91.23 v15.75,91 | X2.DOUT v23.49,83.69 24.45,83.69 24.95,83.19 25.72,83.19 26.43,82.47 | v33.91,73.6 33.91,73.88 X8.DIN_C1
  Bottom 0.178: 16.4,85.2 X1.DIN | X2.DOUT1 28.23,78.36 28.19,78.36 26.92,79.63 25.96,79.63 25.78,79.45 24.05,79.45 23.75,79.76
  Bottom 0.254: v15.75,91 16.4,90.34 16.4,85.2 | v23.49,83.69 22.95,83.15 22.95,80.56 23.75,79.76 | X8.DIN_C 29.08,73.98 29.84,73.22 33.53,73.22 v33.91,73.6
N$2
  Top 0.203: X1.DA 6.98,88.27 X1.D+
N$3  (via drill 0.5)
  Top 0.254: v15.75,92.52 16.15,92.93 X1.DIN_C1
  Bottom 0.254: X1.DIN_C 10.03,93.03 10.79,92.27 15.49,92.27 v15.75,92.52
N$4
  Top 0.203: X2.DA 26.03,88.27 X2.D+
N$5
  Top 0.203: X4.DA 64.13,88.27 X4.D+
N$6  (via drill 0.5)
  Top 0.203: 7.38,82.47 X1.2-DOUT
  Top 0.254: X1.DOUT v4.44,83.69 5.4,83.69 5.9,83.19 6.67,83.19 7.38,82.47 | v15.75,73.47 16.15,73.88 X7.DIN_C1
  Bottom 0.178: X7.DIN_C X1.DOUT1 9.18,78.36 9.14,78.36 7.87,79.63 4.85,79.63 4.84,79.62
  Bottom 0.254: v4.44,83.69 3.9,83.15 3.9,80.56 4.84,79.62 | X7.DIN_C 10.03,73.98 10.79,73.22 15.49,73.22 v15.75,73.47
N$7
  Top 0.254: X7.D+ 6.98,69.09 3.94,72.14 X7.DA
N$8  (via drill 0.5)
  Top 0.254: v33.27,92.39 33.81,92.93 X2.DIN_C1
  Bottom 0.254: X2.DIN_C 29.08,93.03 29.84,92.27 33.15,92.27 v33.27,92.39
N$9
  Top 0.203: X3.DA 45.09,88.27 X3.D+
N$10  (via drill 0.5)
  Top 0.178: X2.DIN 40.32,83.69 | 52.98,73.88 X9.DIN_C1 | X3.DOUT1 X9.DIN_C
  Top 0.203: 45.48,82.47 X3.2-DOUT
  Top 0.254: X3.DOUT 40.32,83.69 v42.55,83.69 43.5,83.69 44.01,83.19 44.77,83.19 45.48,82.47 | X2.4-DIN 34.3,80.78 36.96,83.44 X2.DIN | X2.DIN1 35.03,91.23 v34.8,91 | v52.96,73.85 52.98,73.88
  Bottom 0.178: X3.DOUT1 47.22,78.36 46.75,78.83 46.75,78.84 46.07,79.52 45.97,79.52 45.91,79.57 43.18,79.57
  Bottom 0.254: v42.55,83.69 42,83.15 42,80.75 43.18,79.57 | X2.DIN 35.45,85.2 35.45,90.34 v34.8,91 | X9.DIN_C 48.13,73.98 48.9,73.22 51.94,73.22 52.58,73.85 v52.96,73.85
N$11  (via drill 0.5)
  Top 0.178: 53.35,80.78 56.01,83.44 X3.DIN X4.DOUT | X3.DIN1 54.08,91.23 | X4.DOUT1 X10.DIN_C
  Top 0.203: 64.53,82.47 X4.2-DOUT
  Top 0.254: X4.DOUT v61.59,83.69 62.55,83.69 63.06,83.19 63.82,83.19 64.53,82.47 | X3.4-DIN 53.35,80.78 | 54.08,91.23 v53.85,91 | v72.01,73.85 72.03,73.88 X10.DIN_C1
  Bottom 0.178: X4.DOUT1 66.33,78.36 66.28,78.36 65.22,79.41 64.92,79.52 62.09,79.52 61.86,79.74 | 54.5,85.2 X3.DIN
  Bottom 0.254: v61.59,83.69 61.05,83.15 61.05,80.56 61.86,79.74 | v53.85,91 54.5,90.34 54.5,85.2 | X10.DIN_C 67.18,73.98 67.82,73.34 71.37,73.34 71.88,73.85 v72.01,73.85
N$12  (via drill 0.5)
  Top 0.178: 54.25,92.93 X3.DIN_C1
  Top 0.254: v53.85,92.52 54.25,92.93
  Bottom 0.254: X3.DIN_C 48.13,93.03 48.9,92.27 53.59,92.27 v53.85,92.52
N$13  (via drill 0.5)
  Top 0.178: 72.4,80.78 75.06,83.44 X4.DIN X5.DOUT v80.64,83.69 | 91.03,73.88 X11.DIN_C1 | X5.DOUT1 X11.DIN_C
  Top 0.203: 83.58,82.47 X5.2-DOUT
  Top 0.254: X4.4-DIN 72.4,80.78 | X4.DIN1 73.13,91.23 v72.9,91 | v80.64,83.69 81.6,83.69 82.11,83.19 82.87,83.19 83.58,82.47 | v90.93,73.98 91.03,73.88
  Bottom 0.178: 73.55,85.2 X4.DIN | X5.DOUT1 85.33,78.36 84.38,79.3 84.01,79.52 83.31,79.76 80.91,79.74
  Bottom 0.254: v72.9,91 73.55,90.34 73.55,85.2 | v80.64,83.69 80.1,83.15 80.1,80.56 80.91,79.74 | X11.DIN_C 86.23,73.98 87,73.22 90.17,73.22 v90.93,73.98
N$14  (via drill 0.5)
  Top 0.254: v72.9,92.52 73.3,92.93 X4.DIN_C1
  Bottom 0.254: X4.DIN_C 67.18,93.03 67.94,92.27 72.64,92.27 v72.9,92.52
N$15
  Top 0.203: X6.DA 102.23,88.27 X6.D+
N$16  (via drill 0.5)
  Top 0.178: X6.DOUT 97.47,83.69 | 97.47,83.69 v99.7,83.69 | 91.45,80.78 94.11,83.44 X5.DIN 97.47,83.69 | X5.DIN1 92.18,91.23 | X6.DOUT1 X12.DIN_C
  Top 0.203: 102.63,82.47 X6.2-DOUT
  Top 0.254: v99.7,83.69 100.65,83.69 101.16,83.19 101.92,83.19 102.63,82.47 | X5.4-DIN 91.45,80.78 | 92.18,91.23 v91.95,91 | v110.62,73.98 110.72,73.88 X12.DIN_C1
  Bottom 0.178: X6.DOUT1 104.43,78.36 104.38,78.36 103.38,79.36 103.06,79.52 100.19,79.52 99.96,79.74 | 92.6,85.2 X5.DIN
  Bottom 0.254: v99.7,83.69 99.15,83.15 99.15,80.56 99.96,79.74 | v91.95,91 92.6,90.34 92.6,85.2 | X12.DIN_C 105.28,73.98 106.05,73.22 109.86,73.22 v110.62,73.98
N$17  (via drill 0.5)
  Top 0.178: X12.DOUT1 X18.DIN_C
  Top 0.203: X12.DOUT1 106.55,59.31 arc-90 107.76,60.52
  Top 0.254: v110.62,54.93 110.72,54.83 X18.DIN_C1 | X12.2-DOUT 101.8,64.07 99.7,64.07 99.46,63.84 v99.46,63.75 | X12.DOUT 111.38,62.87 111.38,62.29 109.6,60.52 107.76,60.52
  Bottom 0.178: X18.DIN_C 105.28,54.93
  Bottom 0.203: X12.DOUT1 104.08,59.31 arc90 102.87,60.52
  Bottom 0.254: 105.28,54.93 106.05,54.17 109.86,54.17 v110.62,54.93 | v99.46,63.75 99.14,63.43 99.14,61.33 99.95,60.52 102.87,60.52
N$18  (via drill 0.5)
  Top 0.254: v110.11,92.77 110.11,92.93 X6.DIN_C1
  Bottom 0.254: X6.DIN_C 105.28,93.03 106.05,92.27 109.6,92.27 v110.11,92.77
N$19
  Top 0.203: X5.DA 83.19,88.27 X5.D+
N$20  (via drill 0.5)
  Top 0.178: 92.35,92.93 X5.DIN_C1
  Top 0.254: v91.95,92.52 92.35,92.93
  Bottom 0.254: X5.DIN_C 86.23,93.03 87,92.27 91.69,92.27 v91.95,92.52
N$21  (via drill 0.5)
  Top 0.254: X6.4-DIN 110.5,80.78 113.16,83.44 X6.DIN | X6.DIN1 111.23,91.23 v111,91
  Bottom 0.254: X6.DIN 111.65,85.2 111.65,90.34 v111,91
N$23
  Top 0.203: X13.DA 6.98,50.17 X13.D+
N$24
  Top 0.254: X8.DA 23.12,72.26 26.03,69.35 X8.D+
N$25  (via drill 0.5)
  Top 0.178: X9.DIN1 54.08,72.18 | X8.DOUT X9.DIN | X8.DOUT1 X14.DIN_C
  Top 0.203: 26.43,63.42 X8.2-DOUT | 32.26,60.52 31.55,60.52 arc90 30.34,59.31
  Top 0.254: v23.62,63.44 24.19,64.01 25.84,64.01 26.43,63.42 | X8.DOUT1 30.34,59.31 | 32.26,60.52 33.91,60.52 35.12,61.72 35.12,62.8 X8.DOUT | 54.08,72.18 v53.85,71.95 | X9.4-DIN 50.97,61.93 52.62,61.93 53.95,63.26 v53.95,65.53 52.99,64.57 52.92,64.64 X9.DIN | v34.04,54.67 34.19,54.83 X14.DIN_C1
  Bottom 0.178: X14.DIN_C 29.08,54.93
  Bottom 0.203: X8.DOUT1 27.85,59.31 arc90 26.64,60.52 23.94,60.52
  Bottom 0.254: v23.62,63.44 23.49,63.44 22.95,62.89 22.95,61.51 23.94,60.52 | v53.85,71.95 54.5,71.29 54.5,66.08 v53.95,65.53 | 29.08,54.93 29.84,54.17 33.53,54.17 v34.04,54.67
N$26  (via drill 0.5)
  Top 0.178: X13.DOUT1 X19.DIN_C
  Top 0.203: 7.38,44.37 X13.2-DOUT
  Top 0.254: X13.DOUT v4.44,45.59 5.4,45.59 5.9,45.09 6.67,45.09 7.38,44.37 | v15.75,35.37 16.15,35.78 X19.DIN_C1
  Bottom 0.178: 4.71,41.64 6.91,41.66 7.15,41.42 7.81,41.42 arc-90 8.75,40.48 8.82,40.48 9.03,40.26
  Bottom 0.203: X13.DOUT1 9.03,40.26
  Bottom 0.254: v4.44,45.59 3.9,45.05 3.9,42.46 4.71,41.64 | X19.DIN_C 10.03,35.88 10.79,35.12 15.49,35.12 v15.75,35.37
N$27
  Top 0.254: X9.D+ 45.09,69.22 X9.DA
N$28  (via drill 0.5)
  Top 0.178: 54.17,62.8 X9.DOUT X10.DIN | 54.38,54.83 X15.DIN_C1 | X9.DOUT1 X15.DIN_C
  Top 0.203: 45.48,63.42 X9.2-DOUT | 51.31,60.52 50.54,60.52 arc90 49.33,59.31
  Top 0.254: v42.67,63.44 43.24,64.01 44.89,64.01 45.48,63.42 | X9.DOUT1 49.33,59.31 | 51.31,60.52 52.96,60.52 54.17,61.72 54.17,62.8 | X10.DIN1 73.13,72.18 v72.9,71.95 | X10.4-DIN 70.02,61.93 72.18,61.93 72.62,62.37 v72.62,65.28 71.98,64.64 X10.DIN | v52.7,54.42 53.98,54.42 54.38,54.83
  Bottom 0.178: X15.DIN_C 48.13,54.93
  Bottom 0.203: X9.DOUT1 46.84,59.31 arc90 45.58,60.57 42.94,60.57
  Bottom 0.254: v42.67,63.44 42.55,63.44 42,62.89 42,61.51 42.94,60.57 | v72.9,71.95 73.55,71.29 73.55,65.57 73.26,65.28 v72.62,65.28 | 48.13,54.93 48.9,54.17 52.45,54.17 v52.7,54.42
N$29  (via drill 0.5)
  Top 0.178: 15.25,42.68 17.91,45.34 X13.DIN X14.DOUT | X14.DOUT1 X20.DIN_C
  Top 0.203: 26.43,44.37 X14.2-DOUT
  Top 0.254: X13.4-DIN 15.25,42.68 | X13.DIN1 15.98,53.13 v15.75,52.9 | X14.DOUT v23.49,45.59 24.45,45.59 24.95,45.09 25.72,45.09 26.43,44.37 | v33.78,35.5 34.06,35.78 X20.DIN_C1
  Bottom 0.178: 16.4,47.1 X13.DIN | 23.76,41.64 26.32,41.64 arc-90 27.7,40.26 X14.DOUT1
  Bottom 0.254: v15.75,52.9 16.4,52.24 16.4,47.1 | v23.49,45.59 22.95,45.05 22.95,42.46 23.76,41.64 | X20.DIN_C 29.08,35.88 29.72,35.24 33.53,35.24 v33.78,35.5
N$30
  Top 0.254: X10.D+ 64.13,69.22 X10.DA
N$31  (via drill 0.5)
  Top 0.178: 73.22,62.8 X10.DOUT X11.DIN 90.91,64.64 | X11.DIN1 92.18,72.18 | X10.DOUT1 X16.DIN_C
  Top 0.203: 64.53,63.42 X10.2-DOUT | 70.36,60.52 69.59,60.52 arc90 68.38,59.31
  Top 0.254: v61.72,63.44 62.29,64.01 63.94,64.01 64.53,63.42 | X10.DOUT1 68.38,59.31 | 70.36,60.52 72.01,60.52 73.22,61.72 73.22,62.8 | 92.18,72.18 v91.95,71.95 | X11.4-DIN 89.07,61.93 91.23,61.93 91.8,62.5 v91.8,65.28 91.55,65.28 90.91,64.64 | v72.9,54.42 73.3,54.83 X16.DIN_C1
  Bottom 0.178: X16.DIN_C 67.18,54.93
  Bottom 0.203: X10.DOUT1 65.89,59.31 arc90 64.69,60.5 62.05,60.5
  Bottom 0.254: v61.72,63.44 61.59,63.44 61.05,62.89 61.05,61.51 62.05,60.5 | v91.95,71.95 92.6,71.29 92.6,66.08 v91.8,65.28 | 67.18,54.93 67.94,54.17 72.64,54.17 v72.9,54.42
N$32  (via drill 0.5)
  Top 0.178: 16.06,62.8 X7.DOUT X8.DIN | X7.DOUT1 X13.DIN_C | 13.21,60.52 12.44,60.52 arc90 11.23,59.31
  Top 0.203: 7.38,63.42 X7.2-DOUT
  Top 0.254: v14.48,54.42 14.88,54.83 X13.DIN_C1 | v4.57,63.44 5.14,64.01 6.79,64.01 7.38,63.42 | X7.DOUT1 11.23,59.31 | 13.21,60.52 14.86,60.52 16.06,61.72 16.06,62.8 | X8.DIN1 35.03,72.18 v34.8,71.95 | X8.4-DIN 31.92,61.93 33.57,61.93 34.9,63.26 v34.9,65.41 34.65,65.41 33.88,64.64 X8.DIN
  Bottom 0.178: X13.DIN_C 10.03,54.93 | 4.9,60.5 7.54,60.5 arc-90 8.74,59.31
  Bottom 0.203: X7.DOUT1 8.74,59.31
  Bottom 0.254: 10.03,54.93 10.79,54.17 14.22,54.17 v14.48,54.42 | v4.57,63.44 4.44,63.44 3.9,62.89 3.9,61.51 4.9,60.5 | v34.8,71.95 35.45,71.29 35.45,65.96 v34.9,65.41
N$33
  Top 0.254: X11.D+ 83.19,69.09 80.14,72.14 X11.DA
N$34  (via drill 0.5)
  Top 0.178: 92.27,62.8 X11.DOUT X12.DIN 110.07,64.64 | 91.34,54.83 X17.DIN_C1 | X11.DOUT1 X17.DIN_C
  Top 0.203: 83.58,63.42 X11.2-DOUT | 89.41,60.52 88.64,60.52 arc90 87.43,59.31
  Top 0.254: v80.77,63.44 81.34,64.01 83,64.01 83.58,63.42 | X11.DOUT1 87.43,59.31 | 89.41,60.52 91.06,60.52 92.27,61.72 92.27,62.8 | X12.DIN1 111.23,72.18 v111,71.95 | X12.4-DIN 108.12,61.93 110.28,61.93 110.72,62.37 v110.72,64.01 v110.71,64 110.07,64.64 | v91.31,54.8 91.34,54.83
  Bottom 0.178: X17.DIN_C 86.23,55.56
  Bottom 0.203: X11.DOUT1 84.94,59.31 arc90 83.74,60.5 81.1,60.5
  Bottom 0.254: v80.77,63.44 80.64,63.44 80.1,62.89 80.1,61.51 81.1,60.5 | v111,71.95 111.65,71.29 111.65,64.94 v110.72,64.01 | 86.23,55.56 87.63,54.17 90.68,54.17 v91.31,54.8
N$35
  Top 0.203: X15.DA 45.09,50.17 X15.D+
N$36
  Top 0.254: X12.DA 99.19,71.63 101.99,68.83 X12.D+
N$37  (via drill 0.5)
  Top 0.178: X14.DIN 40.32,45.59 | 53.11,35.78 X21.DIN_C1 | X15.DOUT1 X21.DIN_C
  Top 0.203: 45.48,44.37 X15.2-DOUT
  Top 0.254: X15.DOUT 40.32,45.59 v42.55,45.59 43.5,45.59 44.01,45.09 44.77,45.09 45.48,44.37 | X14.4-DIN 34.3,42.68 36.96,45.34 X14.DIN | X14.DIN1 35.03,53.13 v34.8,52.9 | v53.09,35.75 53.11,35.78
  Bottom 0.178: 42.94,41.52 arc90 43,41.45 45.72,41.45 arc-90 46.74,40.44 46.74,40.54 arc90 47.16,40.12 47.95,40.12
  Bottom 0.203: X15.DOUT1 47.99,40.12 47.95,40.12
  Bottom 0.254: v42.55,45.59 42,45.05 42,42.46 42.94,41.52 | X14.DIN 35.45,47.1 35.45,52.24 v34.8,52.9 | X21.DIN_C 48.13,35.88 48.9,35.12 52.45,35.12 v53.09,35.75
N$38  (via drill 0.5)
  Top 0.254: X7.DIN1 15.98,72.18 v15.75,71.95 | X7.4-DIN 12.87,61.93 14.39,61.93 16.36,63.89 v16.36,65.92 16.36,65.15 15.85,64.64 X7.DIN
  Bottom 0.254: v15.75,71.95 16.4,71.29 16.4,65.96 v16.36,65.92
N$39
  Top 0.203: X14.DA 26.03,50.17 X14.D+
N$40
  Top 0.203: X25.DA 6.98,12.07 X25.D+
N$41
  Top 0.203: X16.DA 64.13,50.17 X16.D+
N$42  (via drill 0.5)
  Top 0.178: 72.4,42.68 75.06,45.34 X16.DIN X17.DOUT v80.64,45.59 | 91.54,35.78 X23.DIN_C1 | X17.DOUT1 X23.DIN_C
  Top 0.203: 83.58,44.37 X17.2-DOUT
  Top 0.254: X16.4-DIN 72.4,42.68 | X16.DIN1 73.13,53.13 v72.9,52.9 | v80.64,45.59 81.6,45.59 82.11,45.09 82.87,45.09 83.58,44.37 | v91.31,36.01 91.54,35.78
  Bottom 0.178: 73.55,47.1 X16.DIN
  Bottom 0.203: X17.DOUT1 84.94,40.26 arc90 83.74,41.45 81.1,41.45
  Bottom 0.254: v72.9,52.9 73.55,52.24 73.55,47.1 | v80.64,45.59 80.1,45.05 80.1,42.46 81.1,41.45 | X23.DIN_C 86.23,35.88 87,35.12 90.68,35.12 91.31,35.75 v91.31,36.01
N$43  (via drill 0.5)
  Top 0.203: 7.38,6.27 X25.2-DOUT
  Top 0.254: X25.DOUT v4.44,7.49 5.4,7.49 5.9,6.98 6.67,6.98 7.38,6.27
  Bottom 0.178: 4.71,3.54 arc90 4.86,3.39 7.45,3.39 arc-90 8.69,2.16 9.18,2.16
  Bottom 0.203: 9.18,2.16 X25.DOUT1
  Bottom 0.254: v4.44,7.49 3.9,6.95 3.9,4.36 4.71,3.54
N$44
  Top 0.203: X18.DA 102.23,50.17 X18.D+
N$45  (via drill 0.5)
  Top 0.178: X18.DOUT 97.47,45.59 | 97.47,45.59 v99.7,45.59 | 91.45,42.68 94.11,45.34 X17.DIN 97.47,45.59 | X17.DIN1 92.18,53.13 | X18.DOUT1 X24.DIN_C
  Top 0.203: 102.63,44.37 X18.2-DOUT
  Top 0.254: v99.7,45.59 100.65,45.59 101.16,45.09 101.92,45.09 102.63,44.37 | X17.4-DIN 91.45,42.68 | 92.18,53.13 v91.95,52.9 | v110.62,35.88 110.72,35.78 X24.DIN_C1
  Bottom 0.178: 92.6,47.1 X17.DIN
  Bottom 0.203: X18.DOUT1 104.05,40.26 arc90 102.86,41.45 100.15,41.45
  Bottom 0.254: v99.7,45.59 99.15,45.05 99.15,42.46 100.15,41.45 | v91.95,52.9 92.6,52.24 92.6,47.1 | X24.DIN_C 105.28,35.88 105.92,35.24 109.98,35.24 v110.62,35.88
N$46  (via drill 0.5)
  Top 0.254: X18.4-DIN 110.5,42.68 113.16,45.34 X18.DIN | X18.DIN1 111.23,53.13 v111,52.9
  Bottom 0.254: X18.DIN 111.65,47.1 111.65,52.24 v111,52.9
N$47  (via drill 0.5)
  Top 0.178: 15.25,4.58 17.91,7.24 X25.DIN X26.DOUT
  Top 0.203: 26.43,6.27 X26.2-DOUT
  Top 0.254: X25.4-DIN 15.25,4.58 | X25.DIN1 15.98,15.03 v15.75,14.8 | X26.DOUT v23.49,7.49 24.45,7.49 24.95,6.98 25.72,6.98 26.43,6.27
  Bottom 0.178: 16.4,9 X25.DIN | 23.94,3.37 26.53,3.37 arc-90 27.74,2.16
  Bottom 0.203: X26.DOUT1 27.74,2.16
  Bottom 0.254: v15.75,14.8 16.4,14.14 16.4,9 | v23.49,7.49 22.95,6.95 22.95,4.36 23.94,3.37
N$48
  Top 0.203: X17.DA 83.19,50.17 X17.D+
N$50  (via drill 0.5)
  Top 0.178: 53.35,42.68 56.01,45.34 X15.DIN X16.DOUT | X15.DIN1 54.08,53.13 | X16.DOUT1 X22.DIN_C
  Top 0.203: 64.53,44.37 X16.2-DOUT
  Top 0.254: X16.DOUT v61.59,45.59 62.55,45.59 63.06,45.09 63.82,45.09 64.53,44.37 | X15.4-DIN 53.35,42.68 | 54.08,53.13 v53.85,52.9 | v72.26,35.75 72.29,35.78 X22.DIN_C1
  Bottom 0.178: 54.5,47.1 X15.DIN
  Bottom 0.203: X16.DOUT1 65.82,40.26 arc90 64.57,41.52 61.99,41.52
  Bottom 0.254: v61.59,45.59 61.05,45.05 61.05,42.46 61.99,41.52 | v53.85,52.9 54.5,52.24 54.5,47.1 | X22.DIN_C 67.18,35.88 67.94,35.12 71.63,35.12 v72.26,35.75
N$51
  Top 0.254: X19.D+ 6.98,31.12 X19.DA
N$52  (via drill 0.5)
  Top 0.178: 16.06,24.7 X19.DOUT X20.DIN | X25.DIN_C X19.DOUT1 11.23,21.21 arc-90 12.44,22.42
  Top 0.203: 7.38,25.32 X19.2-DOUT | 13.21,22.42 12.44,22.42
  Top 0.254: v4.57,25.34 5.14,25.91 6.79,25.91 7.38,25.32 | 13.21,22.42 14.86,22.42 16.06,23.62 16.06,24.7 | X20.DIN1 35.03,34.08 v34.8,33.85 | X20.4-DIN 31.92,23.83 34.08,23.83 34.52,24.27 v34.52,27.18 34.52,26.54 X20.DIN | v14.61,16.45 14.61,16.73 X25.DIN_C1
  Bottom 0.178: X19.DOUT1 8.74,21.21 arc90 7.48,22.47
  Bottom 0.203: 4.84,22.47 7.48,22.47
  Bottom 0.254: v4.57,25.34 4.44,25.34 3.9,24.79 3.9,23.41 4.84,22.47 | v34.8,33.85 35.45,33.19 35.45,28.11 v34.52,27.18 | X25.DIN_C 10.03,16.83 10.79,16.06 14.22,16.06 v14.61,16.45
N$53  (via drill 0.5)
  Top 0.254: X19.DIN1 15.98,34.08 v15.75,33.85 | X19.4-DIN 12.87,23.83 15.03,23.83 15.35,24.14 15.35,26.42 v16.23,27.31 15.47,26.54 X19.DIN
  Bottom 0.254: v15.75,33.85 16.4,33.19 16.4,27.47 v16.23,27.31
N$54
  Top 0.254: X20.D+ 26.03,30.99 22.99,34.04 X20.DA
N$55  (via drill 0.5)
  Top 0.178: X21.DIN1 54.08,34.08 | X20.DOUT X21.DIN | X26.DIN_C X20.DOUT1 30.34,21.21 arc-90 31.55,22.42
  Top 0.203: 26.43,25.32 X20.2-DOUT | 32.26,22.42 31.55,22.42
  Top 0.254: v23.62,25.34 24.19,25.91 25.84,25.91 26.43,25.32 | 32.26,22.42 33.91,22.42 35.12,23.62 35.12,24.7 X20.DOUT | 54.08,34.08 v53.85,33.85 | X21.4-DIN 50.97,23.83 52.62,23.83 54.21,25.41 v54.21,27.44 54.21,27.05 53.7,26.54 X21.DIN | v34.16,16.7 34.19,16.73 X26.DIN_C1
  Bottom 0.178: X20.DOUT1 29.02,21.15 27.85,21.15 arc90 26.53,22.47
  Bottom 0.203: 23.89,22.47 26.53,22.47
  Bottom 0.254: v23.62,25.34 23.49,25.34 22.95,24.79 22.95,23.41 23.89,22.47 | v53.85,33.85 54.5,33.19 54.5,27.73 v54.21,27.44 | X26.DIN_C 29.08,16.83 29.84,16.06 33.53,16.06 v34.16,16.7
N$56
  Top 0.254: X21.D+ 45.09,30.99 42.04,34.04 X21.DA
N$58
  Top 0.254: X22.D+ 64.13,31.25 61.22,34.16 X22.DA
N$59  (via drill 0.5)
  Top 0.178: 73.22,24.7 X22.DOUT X23.DIN 91.02,26.54 | X23.DIN1 92.18,34.08 | X28.DIN_C X22.DOUT1 68.44,21.21 arc-90 69.65,22.42
  Top 0.203: 64.53,25.32 X22.2-DOUT | 70.36,22.42 69.65,22.42
  Top 0.254: v61.72,25.34 62.29,25.91 63.94,25.91 64.53,25.32 | 70.36,22.42 72.01,22.42 73.22,23.62 73.22,24.7 | 92.18,34.08 v91.95,33.85 | X23.4-DIN 89.07,23.83 90.59,23.83 92.18,25.41 v92.18,27.44 92.05,27.44 91.09,26.47 91.02,26.54 | v72.26,16.7 72.29,16.73 X28.DIN_C1
  Bottom 0.178: X22.DOUT1 65.89,21.21 arc90 64.63,22.47
  Bottom 0.203: 61.99,22.47 64.63,22.47